# Altium schematic sheet Encoder_adapter.SchDoc
size A4; SheetNumber: 1; SheetTotal: 1; SPICEModelCacheLAHPVHDX: <root> / <DocumentId>LAHPVHDX</DocumentId> / <CacheFrame Number="0"> / <Model Name="cap" Kind="MDL"> / <Text>*Default semiconductor capacitor / .MODEL CAP C()</Text> / </Model> / </CacheFrame> / </root>
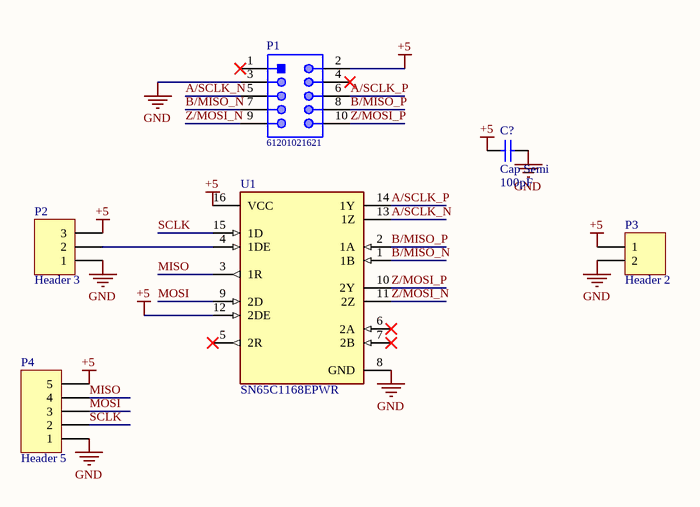
[diagram p0: Encoder_adapter.SchDoc]

## Parts
C?  Cap Semi  value 100pF  [C1206]
P1  61201021621  [61201021621]
P2  Header 3  [HDR1X3]
P3  Header 2  [HDR1X2]
P4  Header 5  [HDR1X5]
U1  SN65C1168EPWR  [FP-PW0016A-IPC_A]

## Nets
+5: C?.1 P1.2 P2.3 P3.1 P4.5 U1.12(2DE) U1.16(VCC)
GND: C?.2 P1.3 P2.1 P3.2 P4.1 U1.8(GND)
A/SCLK_N: P1.5 U1.13(1Z)
A/SCLK_P: P1.6 U1.14(1Y)
B/MISO_N: P1.7 U1.1(1B)
B/MISO_P: P1.8 U1.2(1A)
MISO: P4.4 U1.3(1R)
MOSI: P4.3 U1.9(2D)
SCLK: P4.2 U1.15(1D)
Z/MOSI_N: P1.9 U1.11(2Z)
Z/MOSI_P: P1.10 U1.10(2Y)
NetP2_2: P2.2 U1.4(1DE)

Not connected (* = marked no-connect by the designer): P1 1* 4*; U1 5(2R)* 6(2A)* 7(2B)*

## Library data of the parts
C? = Cap Semi: Capacitor (Semiconductor SIM Model); Published: 8-Jun-2000; LatestRevisionDate: 29-May-2009; LatestRevisionNote: IPC-7351 Footprint Added.; PackageReference: C1206; Publisher: Altium Limited; PackageDescription: Chip Capacitor
P1 = CMP-1502-00007-1: Male Box Header WR-BHD, THT, Vertical, pitch 2.54 mm, 10 pins; Manufacturer: Wurth Elektronik; Contact Resistance: 20mOhm; Withstanding Voltage: 500VAC; Pin Number: 10; Working Voltage: 250VAC; Pitch: 2.54mm; Mounting Technology: THT; Operating Temperature: -40to125degC; Published Date: August2018; Gender: Male; Packaging: Tray; Manufacturer URL: http://www.we-online.de; Datasheet URL: https://katalog.we-online.de/em/datasheet/6120xx21621.pdf; Orientation: Vertical; Package Reference: 61201021621; Part Number: 61201021621; Publisher: WurthElektronik
P2 = Header 3: Header, 3-Pin; LatestRevisionDate: 17-Jul-2002; LatestRevisionNote: Re-released for DXP Platform.; Publisher: Altium Limited
P3 = Header 2: Header, 2-Pin; LatestRevisionDate: 17-Jul-2002; LatestRevisionNote: Re-released for DXP Platform.; Publisher: Altium Limited
P4 = Header 5: Header, 5-Pin; LatestRevisionDate: 17-Jul-2002; LatestRevisionNote: Re-released for DXP Platform.; Publisher: Altium Limited
U1 = CMP-0310-00516-4: None; Supply Current: 9mA; Logic Function: Transceiver; Number of Receivers: 2; Number of Transceivers: 1; Data Rate: 10Mbps; Propagation Delay: 8ns; Max Supply Voltage: 5.5V; Operating Supply Voltage: 5V; Min Supply Voltage: 4.5V; Series: -; Lead Free: Lead Free; Number of Drivers: 2; Min Operating Temperature: -40°C; Case/Package: TSSOP; Operating Supply Current: 9mA; REACH SVHC: No SVHC; Nominal Supply Current: 9mA; Max Operating Temperature: 85°C; Weight: 0.002183oz; Number of Transmitters: 2; Package Quantity: 1; Packaging: Tape and Reel; RoHS Compliant: Yes; Number of Pins: 16